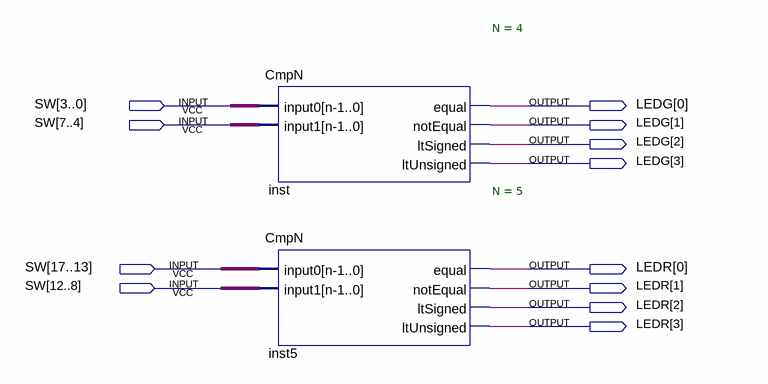
[diagram p0: schematic sheet]
// Quartus schematic CmpN_Demo.bdf as structural Verilog: 2 symbols, 12 pins
module CmpN_Demo (
  input  [17:0] SW,
  output [3:0] LEDG,
  output [3:0] LEDR
);

  CmpN #(.N(4)) inst (
    .input0(SW[3:0]), .input1(SW[7:4]), .equal(LEDG[0]), .notEqual(LEDG[1]), .ltSigned(LEDG[2]),
    .ltUnsigned(LEDG[3]));
  CmpN #(.N(5)) inst5 (
    .input0(SW[17:13]), .input1(SW[12:8]), .equal(LEDR[0]), .notEqual(LEDR[1]), .ltSigned(LEDR[2]),
    .ltUnsigned(LEDR[3]));
endmodule
